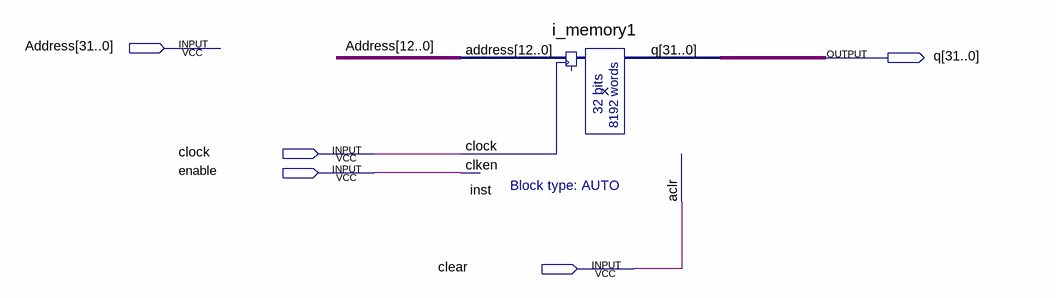
[diagram p0: schematic sheet]
// Quartus schematic instructionMemory.bdf as structural Verilog: 1 symbols, 5 pins
module instructionMemory (
  input  [31:0] Address,
  input  clock,
  input  enable,
  input  clear,
  output [31:0] q
);

  i_memory1 inst (.address(Address[12:0]), .clock(clock), .clken(enable), .aclr(clear), .q(q));
endmodule
